# EAGLE design esp_neopixel (EAGLE 7.7.0)
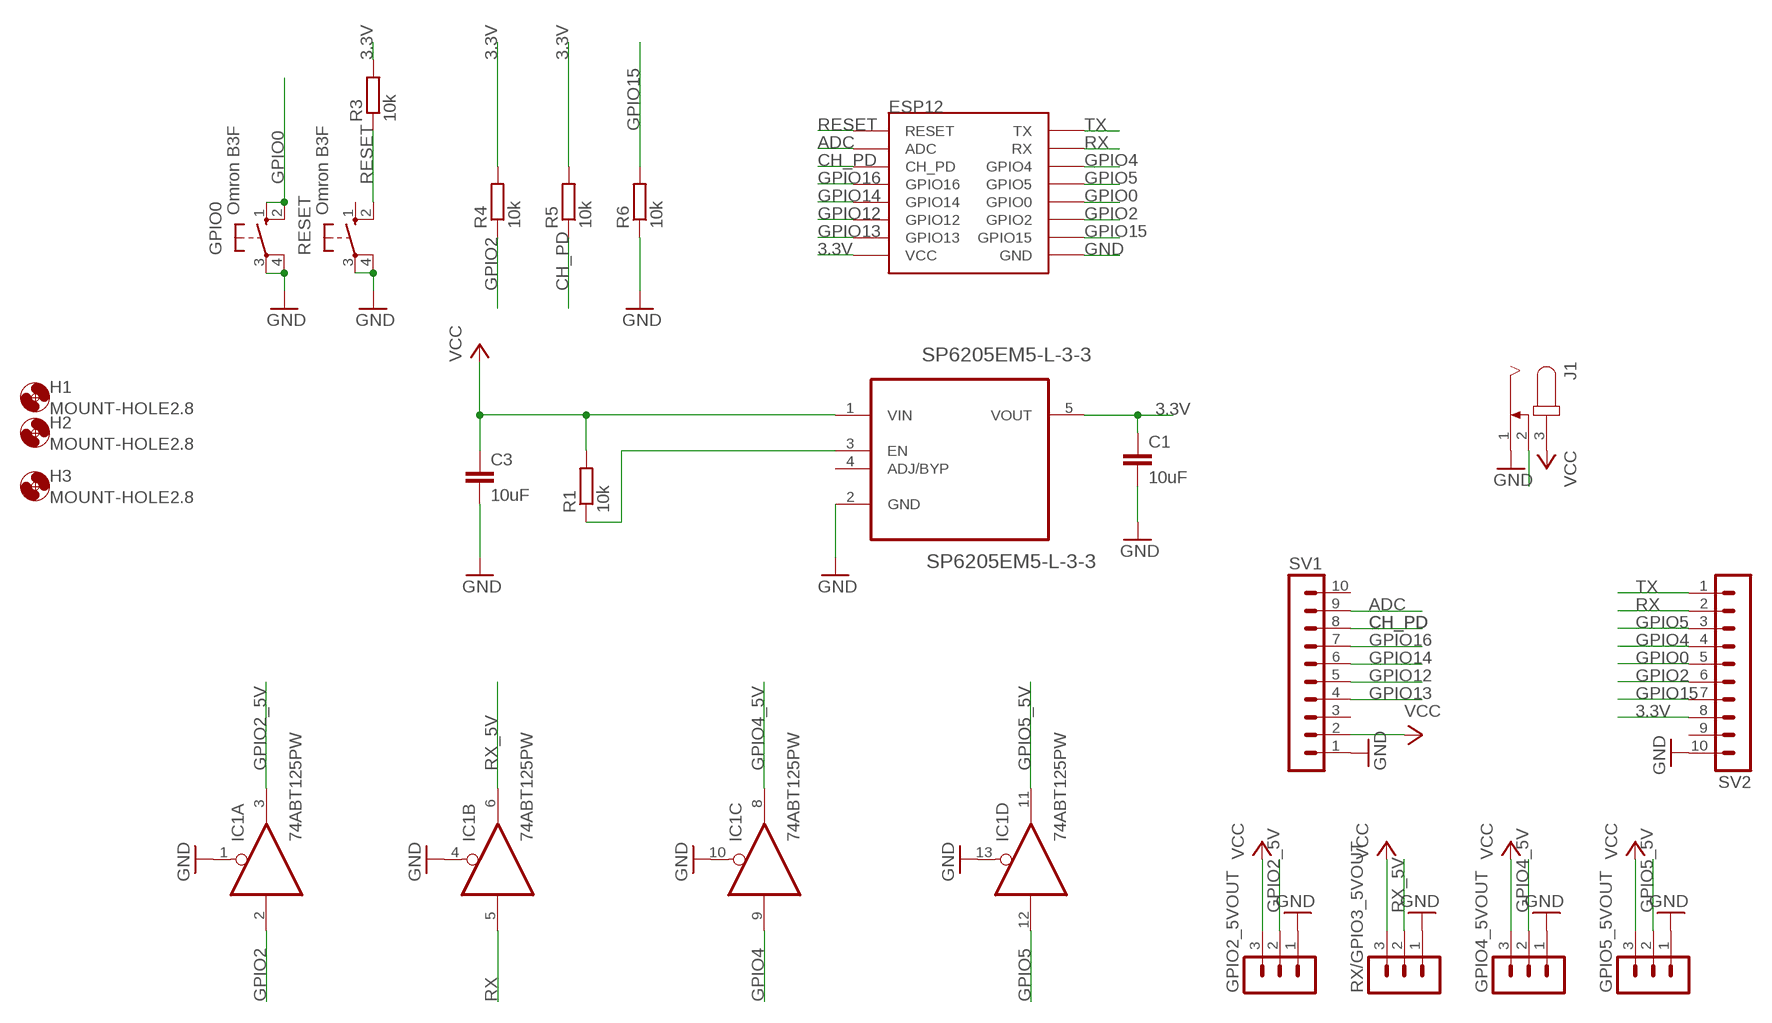
[diagram p0: schematic, sheet 1]

## Parts
C1  10uF  C-EUC0805K  [C0805K]
C3  10uF  C-EUC0805K  [C0805K]
ESP12  ESP12  [ESP12]
GPIO0  Omron B3F  10-XX  [B3F-10XX]
GPIO2_5VOUT  MA03-1  [MA03-1]
GPIO4_5VOUT  MA03-1  [MA03-1]
GPIO5_5VOUT  MA03-1  [MA03-1]
H1  MOUNT-HOLE2.8  [2,8]
H2  MOUNT-HOLE2.8  [2,8]
H3  MOUNT-HOLE2.8  [2,8]
IC1  74ABT125PW  [TSSOP14]
J1  JACK-PLUG1  [SPC4078]
R1  10k  R-EU_M0805  [M0805]
R3  10k  R-EU_M0805  [M0805]
R4  10k  R-EU_M0805  [M0805]
R5  10k  R-EU_M0805  [M0805]
R6  10k  R-EU_M0805  [M0805]
RESET  Omron B3F  10-XX  [B3F-10XX]
RX/GPIO3_5VOUT  MA03-1  [MA03-1]
SP6205EM5-L-3-3  SP6205EM5-L-3-3  SPX3819M5-L  [SOT95P280X145-5N]
SV1  MA10-1W  [MA10-1W]
SV2  MA10-1W  [MA10-1W]

## Nets
3.3V: C1.1 ESP12.VCC R3.2 R4.2 R5.2 SP6205EM5-L-3-3.5(VOUT) SV2.8
ADC: ESP12.ADC SV1.9
CH_PD: ESP12.CH_PD R5.1 SV1.8
GND: C1.2 C3.2 ESP12.GND GPIO0.3(P) GPIO0.4(P1) GPIO2_5VOUT.1 GPIO4_5VOUT.1 GPIO5_5VOUT.1 IC1.1(A:OE) IC1.4(B:OE) IC1.10(C:OE) IC1.13(D:OE) J1.1 R6.1 RESET.3(P) RESET.4(P1) RX/GPIO3_5VOUT.1 SP6205EM5-L-3-3.2(GND) SV1.1 SV2.10
GPIO0: ESP12.GPIO0 GPIO0.1(S) GPIO0.2(S1) SV2.5
GPIO2: ESP12.GPIO2 IC1.2(A:I) R4.1 SV2.6
GPIO2_5V: GPIO2_5VOUT.2 IC1.3(A:O)
GPIO4: ESP12.GPIO4 IC1.9(C:I) SV2.4
GPIO4_5V: GPIO4_5VOUT.2 IC1.8(C:O)
GPIO5: ESP12.GPIO5 IC1.12(D:I) SV2.3
GPIO5_5V: GPIO5_5VOUT.2 IC1.11(D:O)
GPIO12: ESP12.GPIO12 SV1.5
GPIO13: ESP12.GPIO13 SV1.4
GPIO14: ESP12.GPIO14 SV1.6
GPIO15: ESP12.GPIO15 R6.2 SV2.7
GPIO16: ESP12.GPIO16 SV1.7
N$2: R1.1 SP6205EM5-L-3-3.3(EN)
N$3: J1.2
RESET: ESP12.RESET R3.1 RESET.2(S1)
RX: ESP12.RX IC1.5(B:I) SV2.2
RX_5V: IC1.6(B:O) RX/GPIO3_5VOUT.2
TX: ESP12.TX SV2.1
VCC: C3.1 GPIO2_5VOUT.3 GPIO4_5VOUT.3 GPIO5_5VOUT.3 J1.3 R1.2 RX/GPIO3_5VOUT.3 SP6205EM5-L-3-3.1(VIN) SV1.2
Unconnected: RESET.1(S) SP6205EM5-L-3-3.4(ADJ/BYP) SV1.3 SV1.10 SV2.9

## Power pins joined to a net without a drawn wire
GND: IC1.7(P:GND)
VCC: IC1.14(P:VCC)

## Library data of the parts
C1 C3 = rcl:C-EU: CAPACITOR, European symbol
ESP12 = esp8266modules:ESP12: ESP8266 Wifi module 12
GPIO0 RESET = switch-omron:10-XX: OMRON SWITCH; MPN: B3F-1000; OC_FARNELL: 176432; OC_NEWARK: 36M3542
GPIO2_5VOUT GPIO4_5VOUT GPIO5_5VOUT RX/GPIO3_5VOUT = con-lstb:MA03-1: PIN HEADER; OC_FARNELL: unknown; OC_NEWARK: unknown
H1-H3 = holes:MOUNT-HOLE: MOUNTING HOLE with drill center marker
IC1 = 74xx-eu:74*125: Quad bus BUFFER, 3-state
J1 = con-jack:JACK-PLUG: DC POWER JACK Power Jack, DC, Right Angle, Through Hole, Rated 5A at 16VDC, PC Terminals Distributor: Farnell (www.Farnell.de) Drawing: 84N1161.pdf / 84N1162.pdf Manufacturer: SPC Technology (www.spctechnology.com) Type: SPC4077 / SPC 4078; OC_FARNELL: unknown; OC_NEWARK: unknown
R1 R3-R6 = rcl:R-EU_: RESISTOR, European symbol
SP6205EM5-L-3-3 = Exar_By_element14_Batch_1:SPX3819M5-L: 500mA, LOW-NOISE LDO VOLTAGE REGULATOR; MPN: SPX3819M5-L; OC_FARNELL: 1831948; OC_NEWARK: 23R9689; PACKAGE: SOT-23-5; SUPPLIER: EXAR
SV1 SV2 = con-lstb:MA10-1W: PIN HEADER; OC_FARNELL: unknown; OC_NEWARK: unknown

## Net classes
0 default: clearance 0.205 mm

## Board
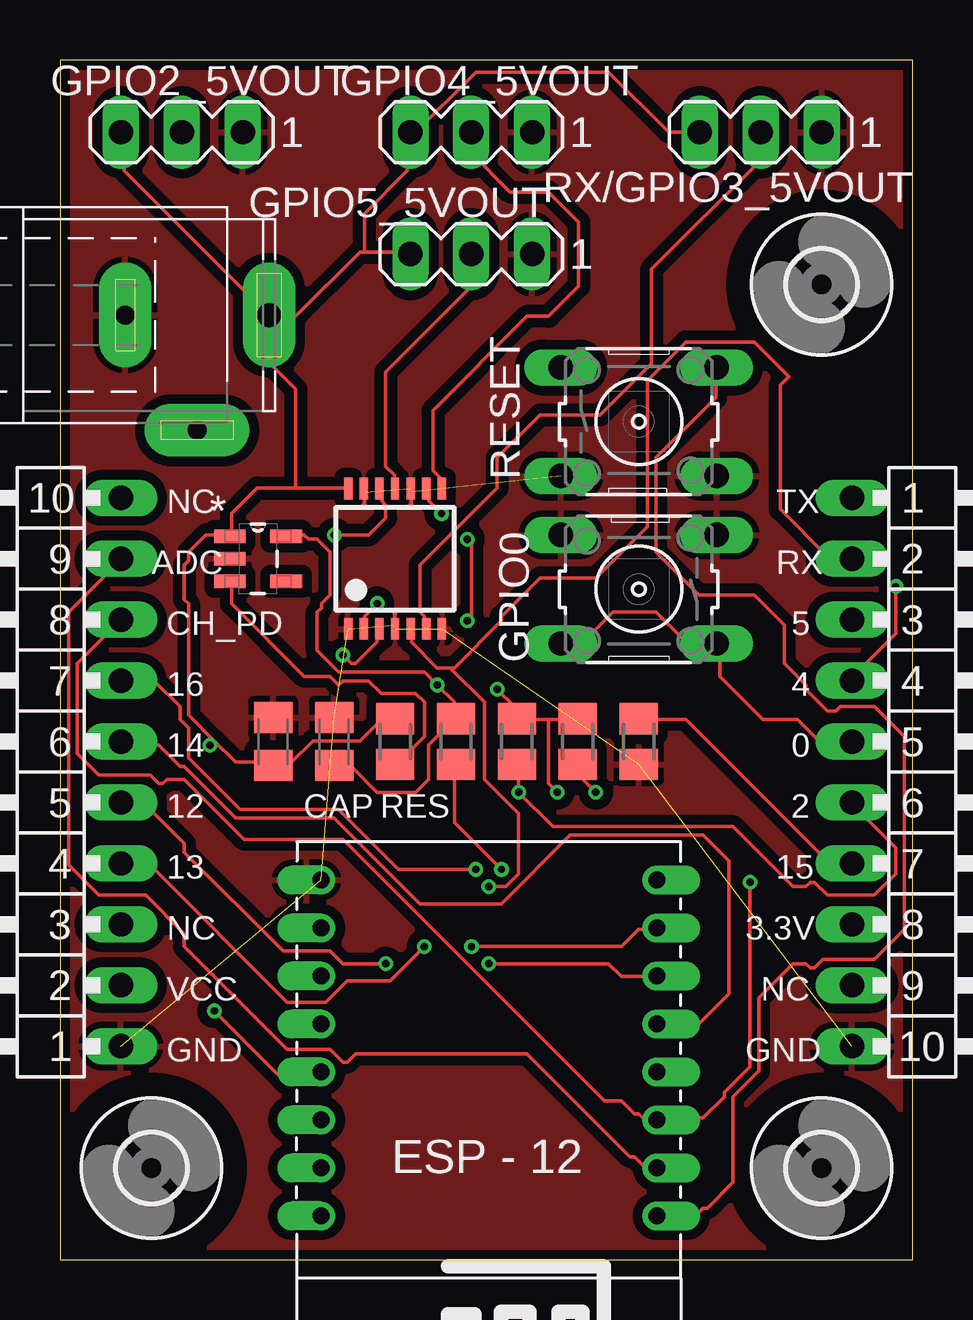
[diagram p1: board, top side]
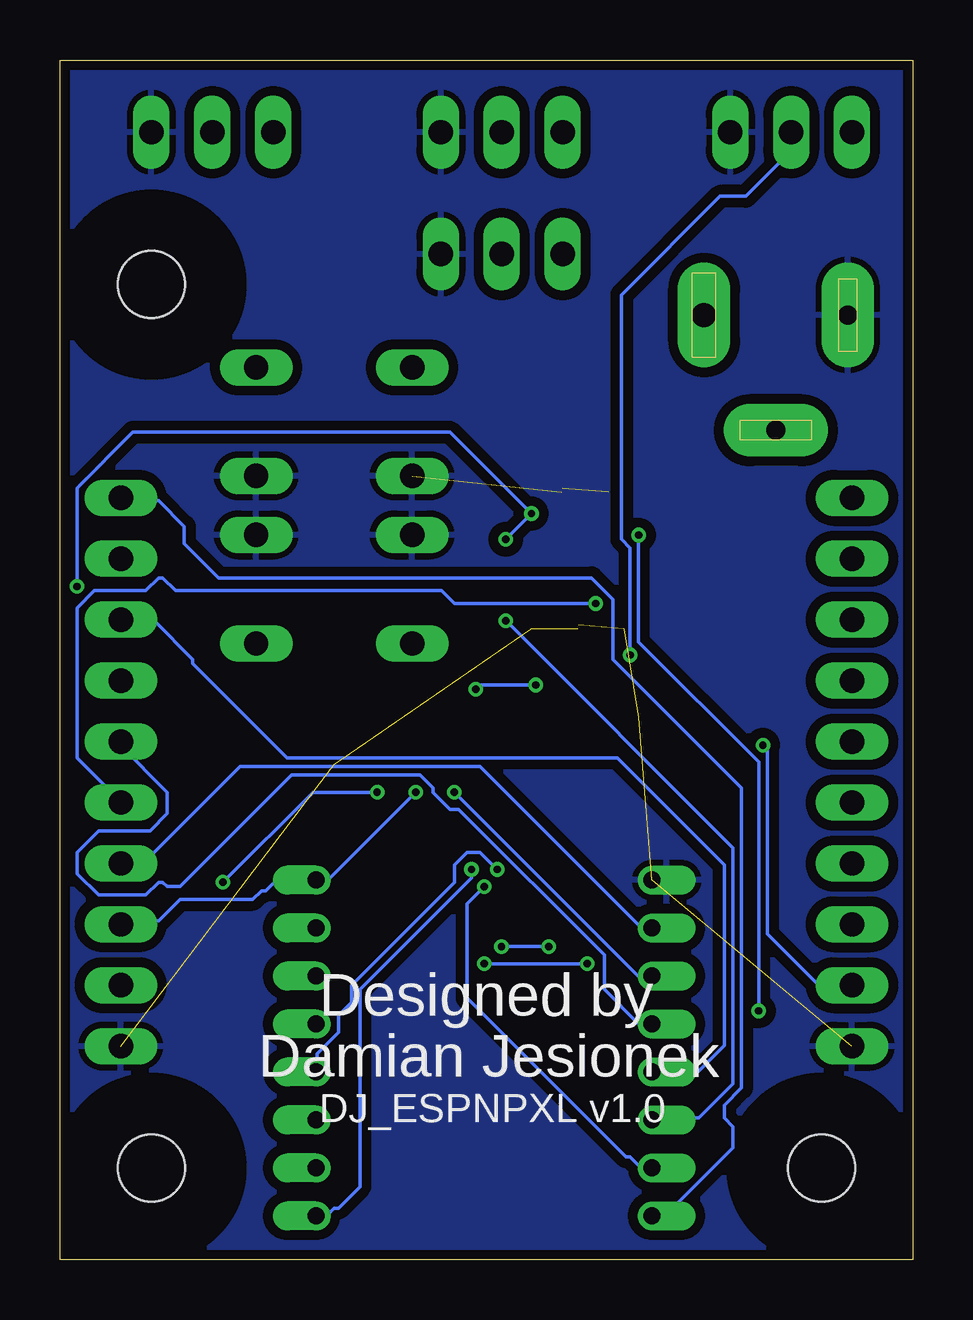
[diagram p2: board, bottom side, seen from below]

Size 35.56 x 50 mm. Coordinates in mm from the lower left corner, seen from the top.
Outline: 0,0 35.56,0 35.56,50 0,50 0,0
Copper layers (1*16): Top 0.035mm / dielectric 1.5mm / Bottom 0.035mm
Design rules "SeeedStudio_2layer_DRU_no_angle_20140221": minimum track width 6mil, minimum drill 12mil, track to track 6mil, track to pad 6mil, pad to pad 6mil, via to via 6mil, smd to smd 0mil, copper to edge 10mil, drill to drill 10mil, minimum pad ring 10mil, minimum via ring 6mil, stop-mask expansion 2mil, vias tented up to drill 100mil, thermal gap 10mil

### Footprints (pad centres in the part's own frame; a part is rotated, then mirrored left to right if it is on the bottom)
C0805K = smd 1.3 x 1.6: 1 -1,0; 2 1,0
ESP12 = drill 0.7 offset: ADC -7.1,3.8; CH_PD -7.1,1.8; GND 6.9,-8.2; GPIO0 6.9,-2.2; GPIO2 6.9,-4.2; GPIO4 6.9,1.8; GPIO5 6.9,-0.2; GPIO12 -7.1,-4.2; GPIO13 -7.1,-6.2; GPIO14 -7.1,-2.2; GPIO15 6.9,-6.2; GPIO16 -7.1,-0.2; RESET -7.1,5.8; RX 6.9,3.8; TX 6.9,5.8; VCC -7.1,-8.2
B3F-10XX = drill 1.016 long: 1 -3.251,2.261; 2 3.251,2.261; 3 -3.251,-2.261; 4 3.251,-2.261
MA03-1 = drill 1.016 long: 1 -2.54,0; 2 0,0; 3 2.54,0
2,8 = hole 2.8: 0,0
TSSOP14 = smd 0.35 x 0.9: 1 -1.95,-2.925; 2 -1.3,-2.925; 3 -0.65,-2.925; 4 0,-2.925; 5 0.65,-2.925; 6 1.3,-2.925; 7 1.95,-2.925; 8 1.95,2.925; 9 1.3,2.925; 10 0.65,2.925; 11 0,2.925; 12 -0.65,2.925; 13 -1.3,2.925; 14 -1.95,2.925
SPC4078 = drill 0.8 pad 2.184 long: 1 -3,0; 2 0,-4.8 | drill 1 pad 2.184 long: 3 3,0
M0805 = smd 1.3 x 1.6: 1 -0.95,0; 2 0.95,0
SOT95P280X145-5N = smd 1.321 x 0.559: 1 -1.168,0.94; 2 -1.168,0; 3 -1.168,-0.94; 4 1.168,-0.94; 5 1.168,0.94
MA10-1W = drill 1.016 long: 1 -11.43,0; 2 -8.89,0; 3 -6.35,0; 4 -3.81,0; 5 -1.27,0; 6 1.27,0; 7 3.81,0; 8 6.35,0; 9 8.89,0; 10 11.43,0

### Placement (x,y rotation side)
C1  11.43,21.59 90 top
C3  8.89,21.59 90 top
ESP12  17.78,7.62 180 top
GPIO0  24.13,27.94 180 top
GPIO2_5VOUT  5.08,46.99 180 top
GPIO4_5VOUT  17.14,46.99 180 top
GPIO5_5VOUT  17.14,41.91 180 top
H1  3.81,3.81 0 top
H2  31.75,3.81 0 top
H3  31.75,40.64 0 top
IC1  13.97,29.21 0 top
J1  5.71,39.37 0 top
R1  13.97,21.59 90 top
R3  16.51,21.59 90 top
R4  19.05,21.59 90 top
R5  21.59,21.59 90 top
R6  24.13,21.59 90 top
RESET  24.13,34.92 0 top
RX/GPIO3_5VOUT  29.21,46.99 180 top
SP6205EM5-L-3-3  8.26,29.21 0 top
SV1  2.54,20.32 90 top
SV2  33.02,20.32 270 top

### Tracks (layer width: path | path; a pad name or v marks a point on that pad's centre or on a via)
3.3V  (via drill 0.3)
  Top 0.152: SP6205EM5-L-3-3.5 9.47,30.2 10.19,30.2 10.37,30.02 10.72,30.02 11.26,29.48 11.26,27.7 10.9,27.34 10.9,27.16 10.72,26.98 10.72,25.38 11.62,24.48 15.19,24.48 v15.73,23.95 16.44,23.23 16.44,22.7 R3.2 16.44,22.52 15.37,21.44 15.37,20.01 14.83,19.48 13.22,19.48 12.15,20.55 11.44,20.55 C1.1 | 20.37,22.52 21.44,22.52 R5.2 | 20.37,22.52 19.12,22.52 R4.2 18.94,22.7 18.94,23.05 v18.23,23.77 | 20.37,22.52 20.37,19.84 v20.73,19.48
  Bottom 0.152: SV2.8 32.88,14.12 31.45,14.12 30.56,15.01 27.52,15.01 27.16,15.37 26.98,15.37 26.63,15.73 25.02,15.73 ESP12.VCC 24.84,15.9 24.3,15.9 v20.73,19.48 | v15.73,23.95 18.05,23.95 v18.23,23.77
ADC
  Top 0.152: ESP12.ADC 24.84,3.93 24.3,3.93 23.95,4.29 23.77,4.29 19.48,8.58 12.33,8.58 11.97,8.22 11.79,8.22 11.26,8.76 9.47,8.76 5.18,13.04 5.18,13.58 3.57,15.19 1.61,15.19 0.36,16.44 0.36,26.98 2.5,29.13 SV1.9
CH_PD  (via drill 0.3)
  Top 0.152: v22.34,19.48 21.62,20.19 21.62,20.55 R5.1 | v28.77,15.73 28.77,8.04 27.7,6.97 27.7,6.79 26.8,5.9 25.02,5.9 ESP12.CH_PD 24.84,5.9 24.3,5.9 24.12,6.08 23.95,6.08 23.41,6.61 22.7,6.61 11.79,17.51 7.68,17.51 5.18,20.01 4.47,20.01 4.29,19.84 4.11,19.84 3.75,20.19 1.61,20.19 0.71,21.09 0.71,24.84 2.5,26.63 SV1.8
  Bottom 0.152: v22.34,19.48 25.02,19.48 v28.77,15.73
GND  (9 unrouted)
  Top 0.152: IC1.4 13.94,26.45 13.94,26.98 13.97,27.01 | IC1.13 12.69,31.99 12.69,31.45 12.67,31.41 | IC1.10 14.65,31.99 14.65,31.45 14.62,31.41
  pour Bottom (isolate 0.406): 0,0 0,50 35.56,50 35.56,0
  pour Top (isolate 0.406): 0,0 35.56,0 35.56,50 0,50
GPIO0
  Top 0.152: GPIO0.2 20.91,25.73 21.8,25.73 23.05,26.98 24.84,26.98 26.09,25.73 27.34,25.73 GPIO0.1 27.52,25.55 27.52,24.3 29.31,22.52 30.74,22.52 31.63,21.62 32.88,21.62 SV2.5
  Bottom 0.152: ESP12.GPIO0 10.9,9.83 11.44,9.83 12.87,11.26 12.87,12.69 18.94,18.76 19.3,18.76 20.01,19.48 20.01,19.66 20.55,20.19 25.91,20.19 30.56,15.55 31.09,15.55 31.27,15.73 31.45,15.73 31.99,15.19 33.95,15.19 34.85,16.08 34.85,16.98 33.95,17.87 31.81,17.87 31.09,18.59 31.09,19.48 33.06,21.44 SV2.5
GPIO2  (via drill 0.3)
  Top 0.152: v13.22,27.34 12.69,26.8 12.69,26.45 IC1.2 | R4.1 19.12,20.55 v19.12,19.48 20.55,18.05 28.06,18.05 30.56,15.55 31.09,15.55 31.27,15.73 31.45,15.73 31.99,15.19 33.95,15.19 34.85,16.08 34.85,17.16 33.06,18.94 SV2.6
  Bottom 0.152: v13.22,27.34 19.12,27.34 19.66,27.88 30.74,27.88 31.27,28.41 31.45,28.41 31.99,27.88 34.13,27.88 34.85,27.16 34.85,20.91 33.06,19.12 SV2.6 | v19.12,19.48 11.44,11.79 10.9,11.79 ESP12.GPIO2
GPIO2_5V  (via drill 0.3)
  Top 0.152: v11.79,25.2 12.15,24.84 12.33,24.84 13.22,25.73 13.22,26.27 IC1.3
  Bottom 0.152: v11.79,25.2 11.79,29.66 12.15,30.02 12.15,40.21 8.04,44.32 6.97,44.32 5.18,46.1 5.18,46.82 GPIO2_5VOUT.2
GPIO4  (via drill 0.3)
  Top 0.152: v15.9,31.09 15.37,31.63 15.37,31.99 IC1.9 | v34.85,28.06 34.85,26.09 33.06,24.3 SV2.4 | v16.98,26.63 17.16,26.8 17.16,29.84 v16.98,30.02
  Bottom 0.152: v34.85,28.06 34.85,32.17 32.52,34.49 19.3,34.49 v15.9,31.09 v16.98,30.02 | v16.98,26.63 7.5,17.16 7.5,7.33 8.94,5.9 10.72,5.9 ESP12.GPIO4
GPIO4_5V
  Top 0.152: IC1.8 15.9,32.17 15.9,32.52 15.55,32.88 15.55,35.38 19.48,39.31 20.37,39.31 21.62,40.56 21.62,43.24 20.37,44.5 18.76,44.5 17.16,46.1 17.16,46.82 GPIO4_5VOUT.2
GPIO5  (via drill 0.3)
  Top 0.152: v11.44,30.2 12.87,30.2 13.58,30.91 13.58,31.45 13.4,31.63 13.4,31.99 IC1.12 | v6.43,10.37 9.11,7.68 10.72,7.68 ESP12.GPIO5
  Bottom 0.152: v11.44,30.2 11.44,25.73 6.43,20.73 v6.43,10.37 | SV2.3 32.88,26.63 31.63,26.63 30.02,25.02 30.02,24.84 26.09,20.91 12.33,20.91 7.86,16.44 7.86,8.94 9.11,7.68 10.72,7.68 ESP12.GPIO5
GPIO5_5V
  Top 0.152: IC1.11 13.94,32.17 13.94,32.7 13.58,33.06 13.58,36.99 16.98,40.39 16.98,41.82 GPIO5_5VOUT.2
GPIO12  (via drill 0.3)
  Top 0.152: v17.87,12.33 22.87,12.33 23.41,11.79 24.84,11.79 ESP12.GPIO12 | v13.58,12.33 11.79,12.33 11.26,12.87 9.29,12.87 5.18,16.98 5.18,17.33 3.57,18.94 2.68,18.94 SV1.5
  Bottom 0.152: v13.58,12.33 v17.87,12.33
GPIO13  (via drill 0.3)
  Top 0.152: v17.16,13.04 23.41,13.04 24.12,13.76 24.84,13.76 ESP12.GPIO13 | v15.19,13.04 13.76,11.62 11.97,11.62 11.08,10.72 9.47,10.72 3.75,16.44 2.68,16.44 SV1.4
  Bottom 0.152: v15.19,13.04 v17.16,13.04
GPIO14
  Top 0.152: ESP12.GPIO14 25.02,9.83 26.63,9.83 27.88,11.08 27.88,16.62 26.8,17.69 21.27,17.69 18.41,14.83 15.01,14.83 11.44,18.41 7.33,18.41 5.18,20.55 5,20.55 4.11,21.44 2.68,21.44 SV1.6
GPIO15
  Top 0.152: R6.2 24.3,22.52 26.09,22.52 31.99,16.62 32.88,16.62 SV2.7
  Bottom 0.152: ESP12.GPIO15 10.9,13.94 11.44,13.94 18.05,20.55 28.06,20.55 31.99,16.62 32.88,16.62 SV2.7
GPIO16  (via drill 0.3)
  Top 0.152: v17.33,16.26 14.12,16.26 11.62,18.76 7.5,18.76 5.36,20.91 5.36,22.16 5,22.52 5,23.05 3.93,24.12 2.68,24.12 SV1.7
  Bottom 0.152: v17.33,16.26 18.05,16.98 18.59,16.98 19.12,16.44 19.12,15.73 23.41,11.44 23.41,10.72 23.95,10.19 23.95,9.47 24.84,8.58 24.84,7.86 ESP12.GPIO16
N$2
  Top 0.152: SP6205EM5-L-3-3.3 7.15,28.23 7.15,27.34 10.19,24.3 11.26,24.3 11.62,23.95 11.79,24.12 12.87,24.12 13.4,23.59 14.83,23.59 15.19,23.23 15.19,21.8 14.12,20.73 R1.1
RESET  (via drill 0.3)
  Top 0.152: v18.41,16.26 16.44,18.23 16.44,20.55 R3.1 | RESET.2 27.34,37.17 27.34,35.92 24.84,33.42 24.84,29.48 26.63,27.7 28.95,27.7 30.2,26.45 30.2,24.84 31.09,23.95 31.09,23.77 31.99,22.87 32.34,22.87 32.52,23.05 33.95,23.05 35.2,21.8 35.2,13.76 33.95,12.51 31.81,12.51 31.45,12.15 31.27,12.15 31.09,12.33 30.56,12.33 29.13,10.9 29.13,7.86 28.06,6.79 28.06,3.22 26.98,2.14 26.8,2.14 26.63,1.97 25.02,1.97 ESP12.RESET
  Bottom 0.152: v18.41,16.26 18.41,15.9 23.05,11.26 23.05,3.04 23.95,2.14 24.12,2.14 24.3,1.97 24.84,1.97 ESP12.RESET
RX  (via drill 0.3)
  Top 0.152: 16.26,24.66 16.44,24.66 18.41,26.63 18.41,26.8 20.01,28.41 22.34,28.41 24.48,30.56 24.48,36.63 26.09,38.24 28.95,38.24 30.38,36.81 30.02,36.45 30.02,31.27 31.99,29.31 32.88,29.31 SV2.2 | 16.26,24.66 15.73,24.66 14.65,25.73 14.65,26.27 IC1.5 | v17.87,15.55 18.59,15.55 19.12,16.08 19.12,18.59 17.69,20.01 17.69,23.23 16.26,24.66
  Bottom 0.152: v17.87,15.55 18.59,14.83 18.59,10.9 11.97,4.29 11.79,4.29 11.44,3.93 10.9,3.93 ESP12.RX
RX_5V
  Top 0.152: IC1.6 15.19,26.45 15.19,26.8 15.01,26.98 15.01,28.95 18.23,32.17 18.23,33.42 20.01,35.2 22.52,35.2 24.66,37.35 24.66,41.28 29.13,45.75 29.13,46.82 RX/GPIO3_5VOUT.2
TX
  Bottom 0.152: ESP12.TX 10.72,1.97 10.19,1.97 7.5,4.65 7.5,5.54 7.86,5.9 7.86,6.43 7.15,7.15 7.15,19.66 12.51,25.02 12.51,27.52 13.4,28.41 28.95,28.41 30.38,29.84 30.38,30.56 31.45,31.63 32.88,31.63 SV2.1
VCC  (via drill 0.3)
  Top 0.152: 9.83,32.17 8.22,32.17 7.15,31.09 7.15,30.2 SP6205EM5-L-3-3.1 6.97,30.2 6.08,30.2 5.36,29.48 5.36,29.13 5.18,28.95 5.18,27.52 5.36,27.34 5.36,22.7 6.43,21.62 | 9.83,32.17 11.97,32.17 IC1.14 | 6.43,21.62 7.33,20.73 8.76,20.73 C3.1 8.94,20.73 9.65,20.73 10.54,21.62 12.51,21.62 13.4,22.52 13.94,22.52 R1.2 | 6.43,21.62 v6.25,21.44 | 12.69,41.99 12.51,41.99 9.83,39.31 8.94,39.31 | 12.69,41.99 14.47,41.99 GPIO5_5VOUT.3 | 8.94,39.31 8.76,39.31 J1.3 | GPIO2_5VOUT.3 2.68,46.82 2.68,45.39 8.58,39.49 J1.3 | 12.69,41.99 12.69,43.6 14.47,45.39 14.47,46.82 GPIO4_5VOUT.3 14.65,46.82 17.33,49.5 22.87,49.5 25.38,47 26.63,47 RX/GPIO3_5VOUT.3 | 9.83,32.17 9.83,36.28 8.94,37.17 8.94,39.31 | 8.94,39.31 J1.3
  Bottom 0.152: v6.25,21.44 6.08,21.27 6.08,13.58 3.93,11.44 2.68,11.44 SV1.2

### Text on the board
tNames: NC | TX | ADC | RX | CH_PD | 5 | 16 | 4 | 14 | 0 | 12 | CAP | RES | 2 | 13 | 15 | NC | 3.3V | VCC | NC | GND | GND
bNames: Designed by | Damian Jesionek | DJ_ESPNPXL v1.0